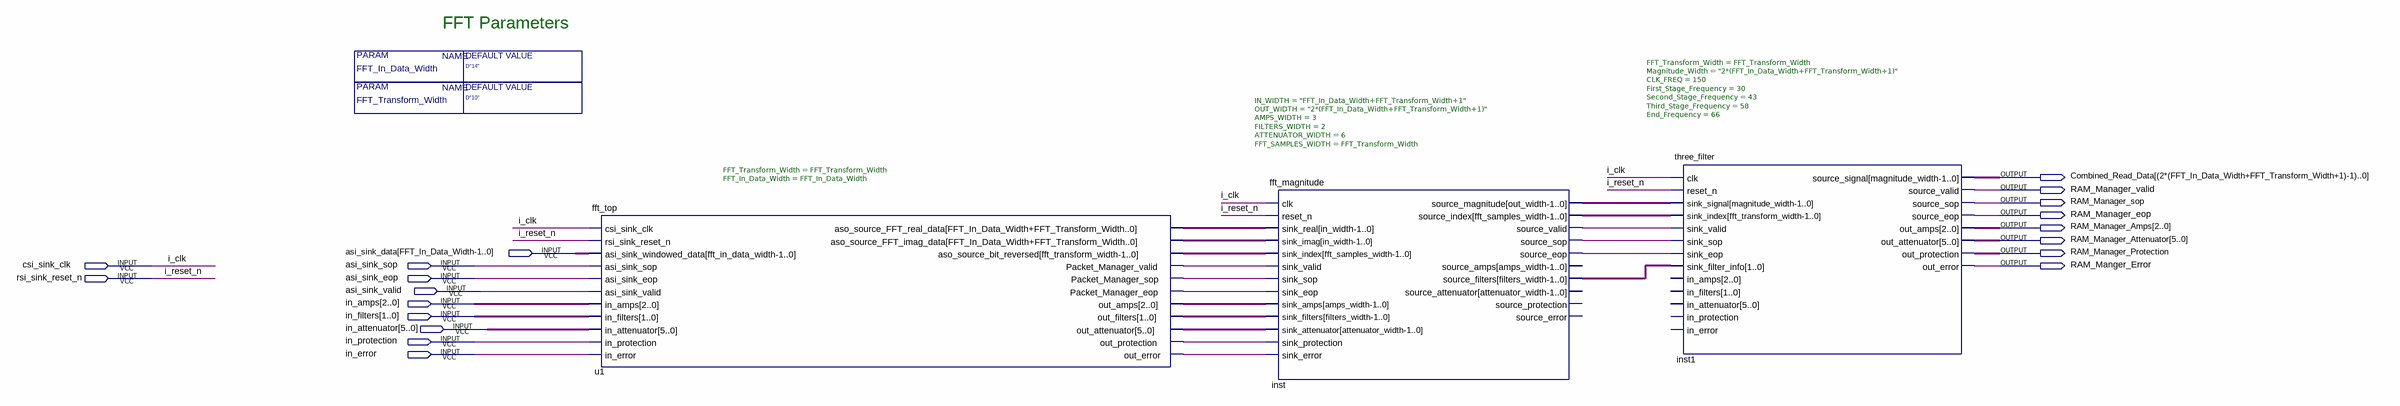
[diagram p0: schematic sheet]
// Quartus schematic dsp_top.bdf as structural Verilog: 3 symbols, 19 pins
module dsp_top #(parameter FFT_Transform_Width = "D\"10\"", parameter FFT_In_Data_Width = "D\"14\"") (
  input  \asi_sink_data[FFT_In_Data_Width-1..0] ,
  input  csi_sink_clk,
  input  asi_sink_sop,
  input  rsi_sink_reset_n,
  input  asi_sink_eop,
  input  asi_sink_valid,
  input  [2:0] in_amps,
  input  [1:0] in_filters,
  input  [5:0] in_attenuator,
  input  in_protection,
  input  in_error,
  output \Combined_Read_Data[(2*(FFT_In_Data_Width+FFT_Transform_Width+1)-1)..0] ,
  output RAM_Manager_valid,
  output RAM_Manager_sop,
  output RAM_Manager_eop,
  output [2:0] RAM_Manager_Amps,
  output [5:0] RAM_Manager_Attenuator,
  output RAM_Manager_Protection,
  output RAM_Manger_Error
);

  wire inst_source_eop, inst_source_index, inst_source_magnitude, inst_source_sop, inst_source_valid,
       u1_aso_source_bit_reversed, u1_aso_source_fft_imag_data, u1_aso_source_fft_real_data, u1_out_error,
       u1_out_protection, u1_packet_manager_eop, u1_packet_manager_sop, u1_packet_manager_valid;
  wire [1:0] inst_source_filters, u1_out_filters;
  wire [2:0] u1_out_amps;
  wire [5:0] u1_out_attenuator;

  fft_top #(.FFT_Transform_Width(FFT_Transform_Width), .FFT_In_Data_Width(FFT_In_Data_Width)) u1 (
    .csi_sink_clk(csi_sink_clk), .rsi_sink_reset_n(rsi_sink_reset_n),
    .asi_sink_windowed_data(\asi_sink_data[FFT_In_Data_Width-1..0] ), .asi_sink_sop(asi_sink_sop),
    .asi_sink_eop(asi_sink_eop), .asi_sink_valid(asi_sink_valid), .in_amps(in_amps), .in_filters(in_filters),
    .in_attenuator(in_attenuator), .in_protection(in_protection), .in_error(in_error),
    .aso_source_FFT_real_data(u1_aso_source_fft_real_data),
    .aso_source_FFT_imag_data(u1_aso_source_fft_imag_data),
    .aso_source_bit_reversed(u1_aso_source_bit_reversed), .Packet_Manager_valid(u1_packet_manager_valid),
    .Packet_Manager_sop(u1_packet_manager_sop), .Packet_Manager_eop(u1_packet_manager_eop),
    .out_amps(u1_out_amps), .out_filters(u1_out_filters), .out_attenuator(u1_out_attenuator),
    .out_protection(u1_out_protection), .out_error(u1_out_error));
  fft_magnitude #(.IN_WIDTH("FFT_In_Data_Width+FFT_Transform_Width+1"), .OUT_WIDTH("2*(FFT_In_Data_Width+FFT_Transform_Width+1)"), .AMPS_WIDTH(3), .FILTERS_WIDTH(2), .ATTENUATOR_WIDTH(6), .FFT_SAMPLES_WIDTH(FFT_Transform_Width)) inst (
    .clk(csi_sink_clk), .reset_n(rsi_sink_reset_n), .sink_real(u1_aso_source_fft_real_data),
    .sink_imag(u1_aso_source_fft_imag_data), .sink_index(u1_aso_source_bit_reversed),
    .sink_valid(u1_packet_manager_valid), .sink_sop(u1_packet_manager_sop), .sink_eop(u1_packet_manager_eop),
    .sink_amps(u1_out_amps), .sink_filters(u1_out_filters), .sink_attenuator(u1_out_attenuator),
    .sink_protection(u1_out_protection), .sink_error(u1_out_error), .source_magnitude(inst_source_magnitude),
    .source_index(inst_source_index), .source_valid(inst_source_valid), .source_sop(inst_source_sop),
    .source_eop(inst_source_eop), .source_filters(inst_source_filters));  // open: source_amps, source_attenuator, source_protection, source_error
  three_filter #(.FFT_Transform_Width(FFT_Transform_Width), .Magnitude_Width("2*(FFT_In_Data_Width+FFT_Transform_Width+1)"), .CLK_FREQ(150), .First_Stage_Frequency(30), .Second_Stage_Frequency(43), .Third_Stage_Frequency(58), .End_Frequency(66)) inst1 (
    .clk(csi_sink_clk), .reset_n(rsi_sink_reset_n), .sink_signal(inst_source_magnitude),
    .sink_index(inst_source_index), .sink_valid(inst_source_valid), .sink_sop(inst_source_sop),
    .sink_eop(inst_source_eop), .sink_filter_info(inst_source_filters),
    .source_signal(\Combined_Read_Data[(2*(FFT_In_Data_Width+FFT_Transform_Width+1)-1)..0] ),
    .source_valid(RAM_Manager_valid), .source_sop(RAM_Manager_sop), .source_eop(RAM_Manager_eop),
    .out_amps(RAM_Manager_Amps), .out_attenuator(RAM_Manager_Attenuator),
    .out_protection(RAM_Manager_Protection), .out_error(RAM_Manger_Error));  // open: in_amps, in_filters, in_attenuator, in_protection, in_error

  // Other names for the same wires on the sheet: i_clk = csi_sink_clk; i_reset_n = rsi_sink_reset_n

  // Notes on the sheet:
  //   FFT Parameters
endmodule
